# Altium project VIDCEnhancer.PrjPcb
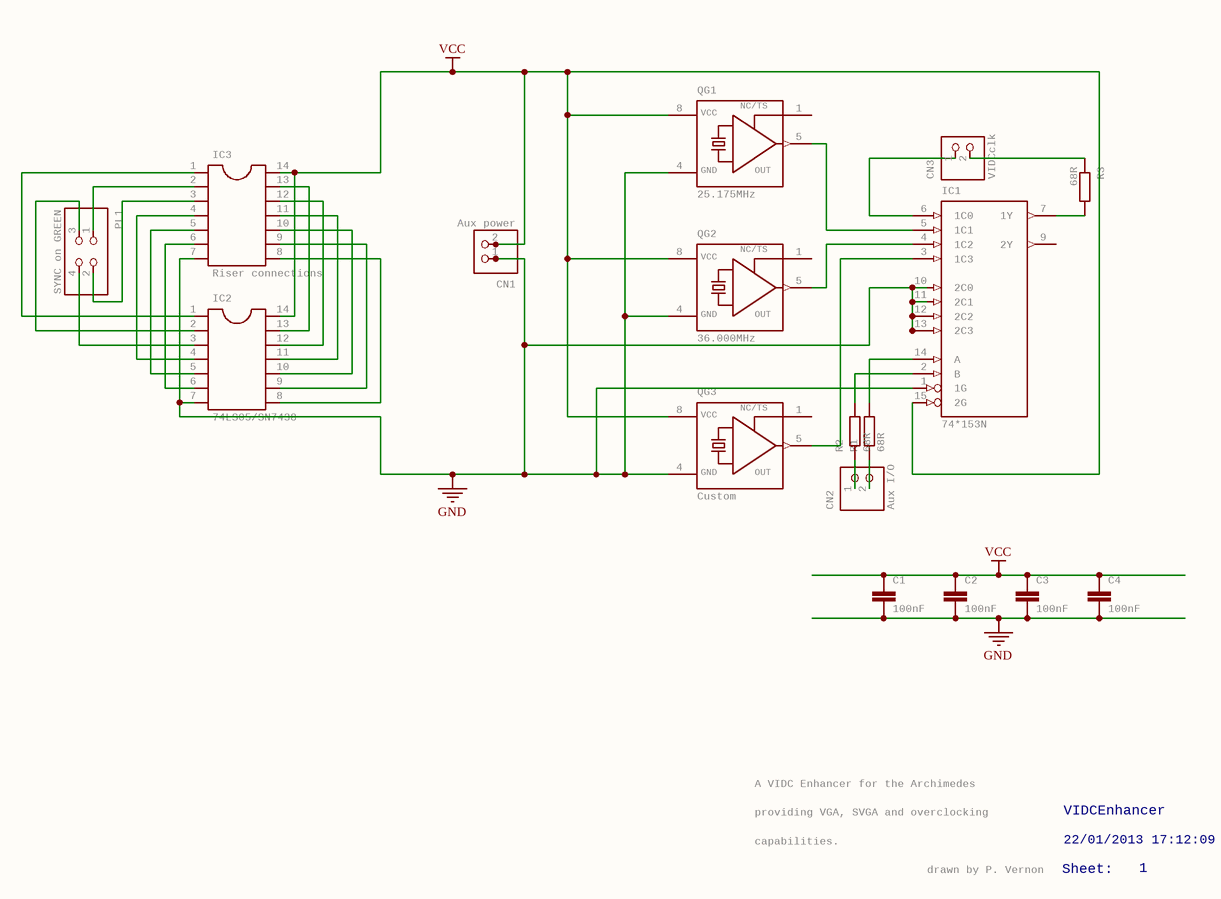
[diagram p0: VIDCEnhancer.SchDoc]
1 sheet, 17 parts. Net scope: global (net labels, ports and power ports of the same name join across sheets).
Board file: VIDCEnhancer.PcbDoc

## Sheet VIDCEnhancer.SchDoc: VIDCEnhancer
size 282 x 197 mm; Origin: Eagle; Date: 22/01/2013 17:12:09; SheetNumber: 1; Value: VIDC Enhancer 2 schematic; GateName_1: G$1; SymbolName_1: A4L-LOC; LibraryName: frames; DeviceSetName: A4L-LOC; Sheet: Sheet:

### Parts
C1  100nF  [C025-025X050]
C2  100nF  [C025-025X050]
C3  100nF  [C025-025X050]
C4  100nF  [C025-025X050]
CN1  Aux power  [1X02/90]
CN2  Aux I/O  [1X02/90]
CN3  VIDCclk  [1X02/90]
IC1  74*153N  [DIL16]
IC2  74LS05/SN7438  [SOCKET-14]
IC3  Riser connections  [SOCKET-14]
PL1  SYNC on GREEN  [2X02]
QG1  25.175MHz  [DIL08S]
QG2  36.000MHz  [DIL08S]
QG3  Custom  [DIL08S]
R1  68R  [0207/10]
R2  68R  [0207/10]
R3  68R  [0207/10]

### Nets
GND: C1.2 C2.2 C3.2 C4.2 CN1.1 IC1.1(1G) IC1.10(2C0) IC1.11(2C1) IC1.12(2C2) IC1.13(2C3) IC2.7 IC3.7 QG1.4(GND) QG2.4(GND) QG3.4(GND)
VCC: C1.1 C2.1 C3.1 C4.1 CN1.2 IC1.15(2G) IC2.14 IC3.14 QG1.8(VCC) QG2.8(VCC) QG3.8(VCC)
NetCN2_1: CN2.1 R2.1
NetCN2_2: CN2.2 R1.1
NetCN3_1: CN3.1 IC1.6(1C0)
NetCN3_2: CN3.2 R3.1
NetIC1_2: IC1.2(B) R2.2
NetIC1_3: IC1.3(1C3) QG3.5(OUT)
NetIC1_4: IC1.4(1C2) QG2.5(OUT)
NetIC1_5: IC1.5(1C1) QG1.5(OUT)
NetIC1_7: IC1.7(1Y) R3.2
NetIC1_14: IC1.14(A) R1.2
NetIC2_1: IC2.1 IC3.1
NetIC2_2: IC2.2 PL1.3
NetIC2_3: IC2.3 PL1.4
NetIC2_4: IC2.4 IC3.4
NetIC2_5: IC2.5 IC3.5
NetIC2_6: IC2.6 IC3.6
NetIC2_8: IC2.8 IC3.8
NetIC2_9: IC2.9 IC3.9
NetIC2_10: IC2.10 IC3.10
NetIC2_11: IC2.11 IC3.11
NetIC2_12: IC2.12 IC3.12
NetIC2_13: IC2.13 IC3.13
NetIC3_2: IC3.2 PL1.1
NetIC3_3: IC3.3 PL1.2

Not connected (* = marked no-connect by the designer): IC1 9(2Y); QG1 1(TS); QG2 1(TS); QG3 1(TS)

### Notes on the sheet
- providing VGA, SVGA and overclocking
- A VIDC Enhancer for the Archimedes
- capabilities.
- VIDCEnhancer
- 22/01/2013 17:12:09
- drawn by P. Vernon
- Sheet:
- 1

### Library data of the parts
C1-C4 = C-EU025-025X050: CAPACITOR, European symbol; GateName_1: G$1; SymbolName_1: C-EU; DeviceName: 025-025X050; LibraryName: rcl; DeviceSetName: C-EU
CN1-CN3 = PINHD-1X2/90: PIN HEADER; GateName_1: G$1; SymbolName_1: PINHD2; DeviceName: /90; LibraryName: pinhead; DeviceSetName: PINHD-1X2
IC1 = 74*153N: Dual 4-line to 1-line data SELECTOR/MULTIPLEXER; GateName_1: A; SymbolName_1: 74153; DeviceName: N; DeviceSetName: 74*153; LibraryName: 74xx-eu
IC2 IC3 = DIL14S: Dual In Line / Socket; GateName_1: G$1; SymbolName_1: DIL14; DeviceName: S; LibraryName: ic-package; DeviceSetName: DIL14
PL1 = PINHD-2X2: PIN HEADER; GateName_1: A; SymbolName_1: PINH2X2; LibraryName: pinhead; DeviceSetName: PINHD-2X2
QG1-QG3 = XO-8: CRYSTAL; GateName_1: G$1; SymbolName_1: QG3; DeviceName: 8; DeviceSetName: XO-; LibraryName: crystal; OUT: OUT; GND: GND; VCC: VCC; NC/TS: NC/TS; MF: MF; MPN: MPN; OC_FARNELL: unknown; OC_NEWARK: unknown
R1-R3 = R-EU_0207/10: RESISTOR, European symbol; GateName_1: G$1; SymbolName_1: R-EU; DeviceSetName: R-EU_; DeviceName: 0207/10; LibraryName: resistor